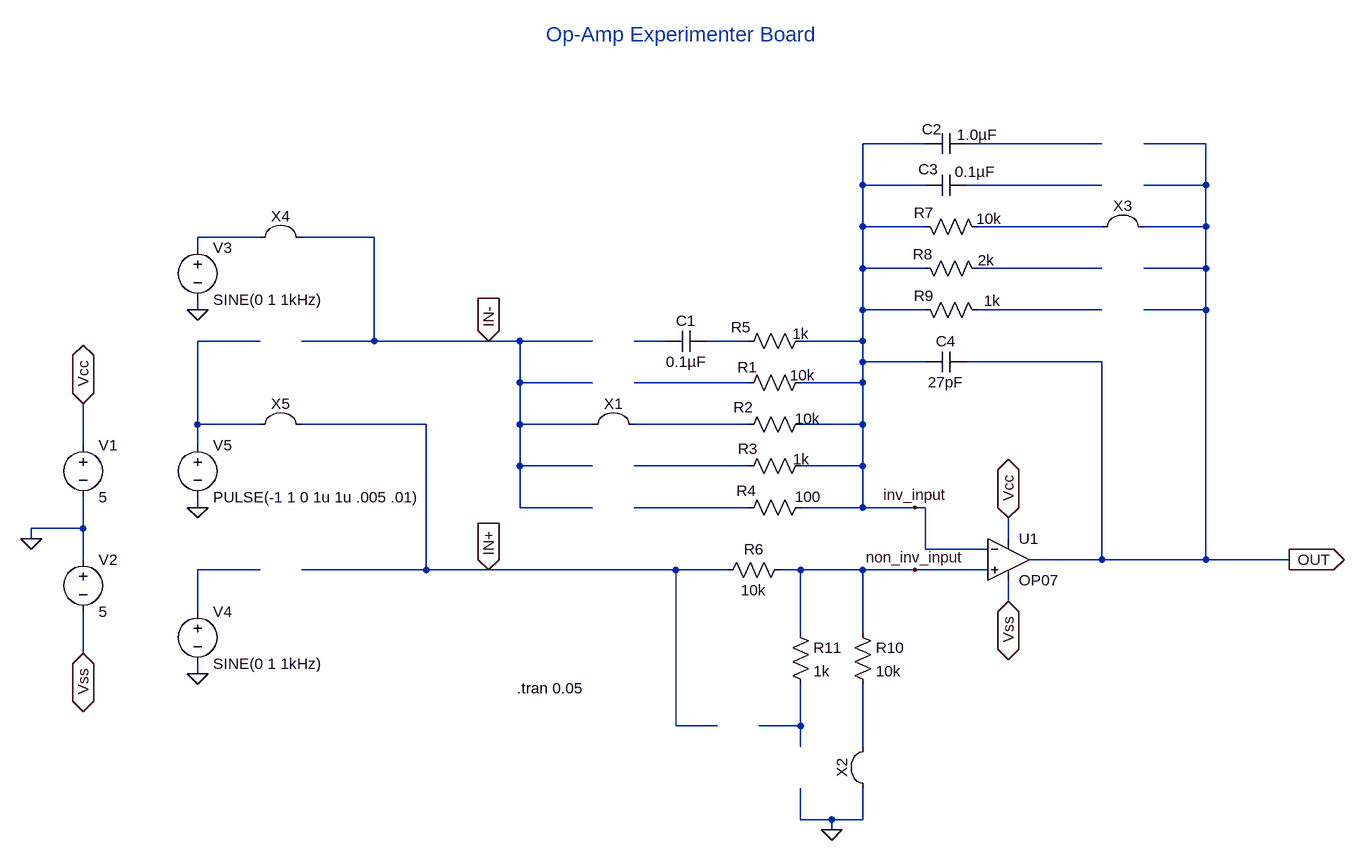
[diagram p0: schematic op_amp_experimenter.asc]
op_amp_experimenter.asc, the LTspice schematic file:
Version 4
SHEET 1 880 840
WIRE 48 -480 -48 -480
WIRE 320 -480 112 -480
WIRE 480 -480 384 -480
WIRE -48 -416 -48 -480
WIRE 48 -416 -48 -416
WIRE 320 -416 112 -416
WIRE 480 -416 480 -480
WIRE 480 -416 384 -416
WIRE -48 -352 -48 -416
WIRE 48 -352 -48 -352
WIRE 320 -352 128 -352
WIRE 480 -352 480 -416
WIRE 480 -352 384 -352
WIRE -976 -336 -1072 -336
WIRE -800 -336 -912 -336
WIRE -1072 -320 -1072 -336
WIRE -48 -288 -48 -352
WIRE 48 -288 -48 -288
WIRE 320 -288 128 -288
WIRE 480 -288 480 -352
WIRE 480 -288 384 -288
WIRE -1072 -224 -1072 -240
WIRE -48 -224 -48 -288
WIRE 48 -224 -48 -224
WIRE 320 -224 128 -224
WIRE 480 -224 480 -288
WIRE 480 -224 384 -224
WIRE -976 -176 -1072 -176
WIRE -800 -176 -800 -336
WIRE -800 -176 -912 -176
WIRE -624 -176 -800 -176
WIRE -576 -176 -624 -176
WIRE -464 -176 -576 -176
WIRE -352 -176 -400 -176
WIRE -224 -176 -288 -176
WIRE -48 -176 -48 -224
WIRE -48 -176 -144 -176
WIRE -48 -144 -48 -176
WIRE 48 -144 -48 -144
WIRE 320 -144 112 -144
WIRE -576 -112 -576 -176
WIRE -464 -112 -576 -112
WIRE -224 -112 -400 -112
WIRE -48 -112 -48 -144
WIRE -48 -112 -144 -112
WIRE -1072 -48 -1072 -176
WIRE -976 -48 -1072 -48
WIRE -720 -48 -912 -48
WIRE -576 -48 -576 -112
WIRE -464 -48 -576 -48
WIRE -224 -48 -400 -48
WIRE -48 -48 -48 -112
WIRE -48 -48 -144 -48
WIRE -1248 -16 -1248 -80
WIRE -1072 -16 -1072 -48
WIRE -576 16 -576 -48
WIRE -464 16 -576 16
WIRE -224 16 -400 16
WIRE -48 16 -48 -48
WIRE -48 16 -144 16
WIRE -1072 80 -1072 64
WIRE -576 80 -576 16
WIRE -464 80 -576 80
WIRE -224 80 -400 80
WIRE -48 80 -48 16
WIRE -48 80 -144 80
WIRE 32 80 -48 80
WIRE 48 80 32 80
WIRE -1248 112 -1248 64
WIRE -1248 112 -1328 112
WIRE -1328 128 -1328 112
WIRE 176 128 176 96
WIRE 48 144 48 80
WIRE 144 144 48 144
WIRE -1248 160 -1248 112
WIRE 320 160 320 -144
WIRE 320 160 208 160
WIRE 480 160 480 -224
WIRE 480 160 320 160
WIRE 608 160 480 160
WIRE -976 176 -1072 176
WIRE -720 176 -720 -48
WIRE -720 176 -912 176
WIRE -624 176 -720 176
WIRE -336 176 -624 176
WIRE -256 176 -336 176
WIRE -144 176 -176 176
WIRE -48 176 -144 176
WIRE 32 176 -48 176
WIRE 144 176 32 176
WIRE 176 224 176 192
WIRE -1072 240 -1072 176
WIRE -144 272 -144 176
WIRE -48 272 -48 176
WIRE -1248 304 -1248 240
WIRE -1072 336 -1072 320
WIRE -336 416 -336 176
WIRE -272 416 -336 416
WIRE -144 416 -144 352
WIRE -144 416 -208 416
WIRE -144 448 -144 416
WIRE -48 448 -48 352
WIRE -144 560 -144 512
WIRE -96 560 -144 560
WIRE -48 560 -48 512
WIRE -48 560 -96 560
WIRE -96 576 -96 560
FLAG 176 224 Vss
IOPIN 176 224 BiDir
FLAG 176 96 Vcc
IOPIN 176 96 BiDir
FLAG -624 -176 IN-
IOPIN -624 -176 In
FLAG -624 176 IN+
IOPIN -624 176 In
FLAG 608 160 OUT
IOPIN 608 160 Out
FLAG -96 576 0
FLAG -1328 128 0
FLAG -1248 -80 Vcc
IOPIN -1248 -80 BiDir
FLAG -1248 304 Vss
IOPIN -1248 304 BiDir
FLAG -1072 336 0
FLAG -1072 -224 0
FLAG 32 80 inv_input
FLAG 32 176 non_inv_input
FLAG -1072 80 0
SYMBOL OpAmps\\OP07 176 96 R0
SYMATTR InstName U1
SYMBOL res -128 -128 R90
WINDOW 0 8 98 VBottom 2
WINDOW 3 -11 13 VTop 2
SYMATTR InstName R1
SYMATTR Value 10k
SYMBOL res -128 -64 R90
WINDOW 0 5 104 VBottom 2
WINDOW 3 -8 5 VTop 2
SYMATTR InstName R2
SYMATTR Value 10k
SYMBOL res -128 0 R90
WINDOW 0 5 97 VBottom 2
WINDOW 3 -10 15 VTop 2
SYMATTR InstName R3
SYMATTR Value 1k
SYMBOL res -128 64 R90
WINDOW 0 6 99 VBottom 2
WINDOW 3 -16 4 VTop 2
SYMATTR InstName R4
SYMATTR Value 100
SYMBOL res -128 -192 R90
WINDOW 0 10 108 VBottom 2
WINDOW 3 -11 16 VTop 2
SYMATTR InstName R5
SYMATTR Value 1k
SYMBOL cap -288 -192 R90
WINDOW 0 0 32 VBottom 2
WINDOW 3 32 32 VTop 2
SYMATTR InstName C1
SYMATTR Value 0.1µF
SYMBOL res 32 -368 M90
WINDOW 0 10 14 VBottom 2
WINDOW 3 -12 114 VTop 2
SYMATTR InstName R7
SYMATTR Value 10k
SYMBOL res 32 -304 M90
WINDOW 0 10 12 VBottom 2
WINDOW 3 -12 110 VTop 2
SYMATTR InstName R8
SYMATTR Value 2k
SYMBOL res 32 -240 M90
WINDOW 0 10 14 VBottom 2
WINDOW 3 -14 119 VTop 2
SYMATTR InstName R9
SYMATTR Value 1k
SYMBOL cap 48 -496 M90
WINDOW 0 10 10 VBottom 2
WINDOW 3 -13 80 VTop 2
SYMATTR InstName C2
SYMATTR Value 1.0µF
SYMBOL Misc\\jumper 352 -416 M0
SYMATTR InstName X3
SYMBOL cap 48 -432 M90
WINDOW 0 7 5 VBottom 2
WINDOW 3 -20 77 VTop 2
SYMATTR InstName C3
SYMATTR Value 0.1µF
SYMBOL res -160 160 R90
WINDOW 0 0 56 VBottom 2
WINDOW 3 32 56 VTop 2
SYMATTR InstName R6
SYMATTR Value 10k
SYMBOL res -64 256 R0
SYMATTR InstName R10
SYMATTR Value 10k
SYMBOL res -160 256 R0
SYMATTR InstName R11
SYMATTR Value 1k
SYMBOL cap 112 -160 R90
WINDOW 0 0 32 VBottom 2
WINDOW 3 32 32 VTop 2
SYMATTR InstName C4
SYMATTR Value 27pF
SYMBOL Misc\\jumper -112 480 R270
SYMATTR InstName X2
SYMBOL voltage -1248 -32 R0
WINDOW 123 0 0 Left 0
WINDOW 39 0 0 Left 0
SYMATTR InstName V1
SYMATTR Value 5
SYMBOL voltage -1248 144 R0
WINDOW 123 0 0 Left 0
WINDOW 39 0 0 Left 0
SYMATTR InstName V2
SYMATTR Value 5
SYMBOL voltage -1072 -336 R0
WINDOW 123 0 0 Left 0
WINDOW 39 0 0 Left 0
SYMATTR InstName V3
SYMATTR Value SINE(0 1 1kHz)
SYMBOL voltage -1072 224 R0
WINDOW 123 0 0 Left 0
WINDOW 39 0 0 Left 0
SYMATTR InstName V4
SYMATTR Value SINE(0 1 1kHz)
SYMBOL Misc\\jumper -432 -112 M0
SYMATTR InstName X1
SYMBOL voltage -1072 -32 R0
WINDOW 123 0 0 Left 0
WINDOW 39 0 0 Left 0
SYMATTR InstName V5
SYMATTR Value PULSE(-1 1 0 1u 1u .005 .01)
SYMBOL Misc\\jumper -944 -400 M0
SYMATTR InstName X4
SYMBOL Misc\\jumper -944 -112 M0
SYMATTR InstName X5
TEXT -580 358 Left 2 !.tran 0.05
TEXT -536 -648 Left 3 ;Op-Amp Experimenter Board

The netlist it stands for:
* op_amp_experimenter.asc
XU1 non_inv_input inv_input Vcc Vss OUT LT1001  ; OP07, pins In+ In- V+ V- OUT
R1 inv_input N007 10k
R2 inv_input IN- 10k
R3 inv_input N008 1k
R4 inv_input N009 100
R5 inv_input N006 1k
C1 N006 N005 0.1µF
R7 inv_input OUT 10k
R8 inv_input N003 2k
R9 inv_input N004 1k
C2 inv_input N001 1.0µF
C3 inv_input N002 0.1µF
R6 non_inv_input IN+ 10k
R10 non_inv_input 0 10k
R11 non_inv_input N011 1k
C4 OUT inv_input 27pF
V1 Vcc 0 5
V2 0 Vss 5
V3 IN- 0 SINE(0 1 1kHz)
V4 N010 0 SINE(0 1 1kHz)
V5 IN+ 0 PULSE(-1 1 0 1u 1u .005 .01)
.tran 0.05
* Op-Amp Experimenter Board
.lib LTC.lib
.backanno
.end